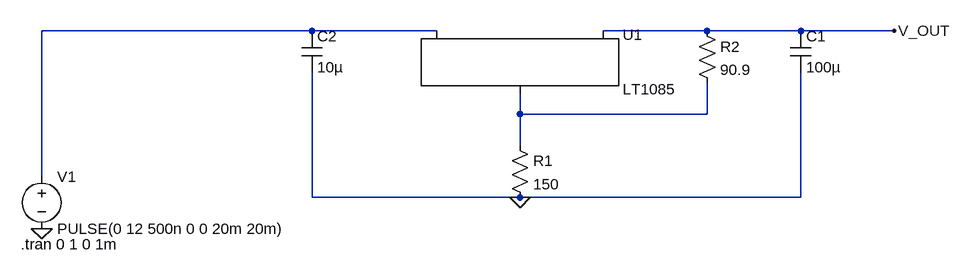
[diagram p0: schematic LT1085_9V_Power_Supply_Schematic.asc]
LT1085_9V_Power_Supply_Schematic.asc, the LTspice schematic file:
Version 4
SHEET 1 1120 680
WIRE 128 224 -288 224
WIRE 320 224 128 224
WIRE 736 224 576 224
WIRE 880 224 736 224
WIRE 1024 224 880 224
WIRE 448 352 448 320
WIRE 736 352 736 304
WIRE 736 352 448 352
WIRE 448 400 448 352
WIRE -288 448 -288 224
WIRE 128 480 128 288
WIRE 448 480 128 480
WIRE 880 480 880 288
WIRE 880 480 448 480
FLAG 448 480 0
FLAG 1024 224 V_OUT
FLAG -288 528 0
SYMBOL PowerProducts\\LT1085 448 224 R0
SYMATTR InstName U1
SYMBOL voltage -288 432 R0
WINDOW 123 0 0 Left 0
WINDOW 39 0 0 Left 0
SYMATTR InstName V1
SYMATTR Value PULSE(0 12 500n 0 0 20m 20m)
SYMBOL res 432 384 R0
SYMATTR InstName R1
SYMATTR Value 150
SYMBOL res 720 208 R0
SYMATTR InstName R2
SYMATTR Value 90.9
SYMBOL cap 864 224 R0
SYMATTR InstName C1
SYMATTR Value 100µ
SYMBOL cap 112 224 R0
SYMATTR InstName C2
SYMATTR Value 10µ
TEXT -320 552 Left 2 !.tran 0 1 0 1m

The netlist it stands for:
* LT1085_9V_Power_Supply_Schematic.asc
XU1 N002 V_OUT N001 LT1085
V1 N001 0 PULSE(0 12 500n 0 0 20m 20m)
R1 N002 0 150
R2 V_OUT N002 90.9
C1 V_OUT 0 100µ
C2 N001 0 10µ
.tran 0 1 0 1m
.backanno
.end